# EAGLE schematic Keyboard_C64_HotSwap (EAGLE 9.6.0)
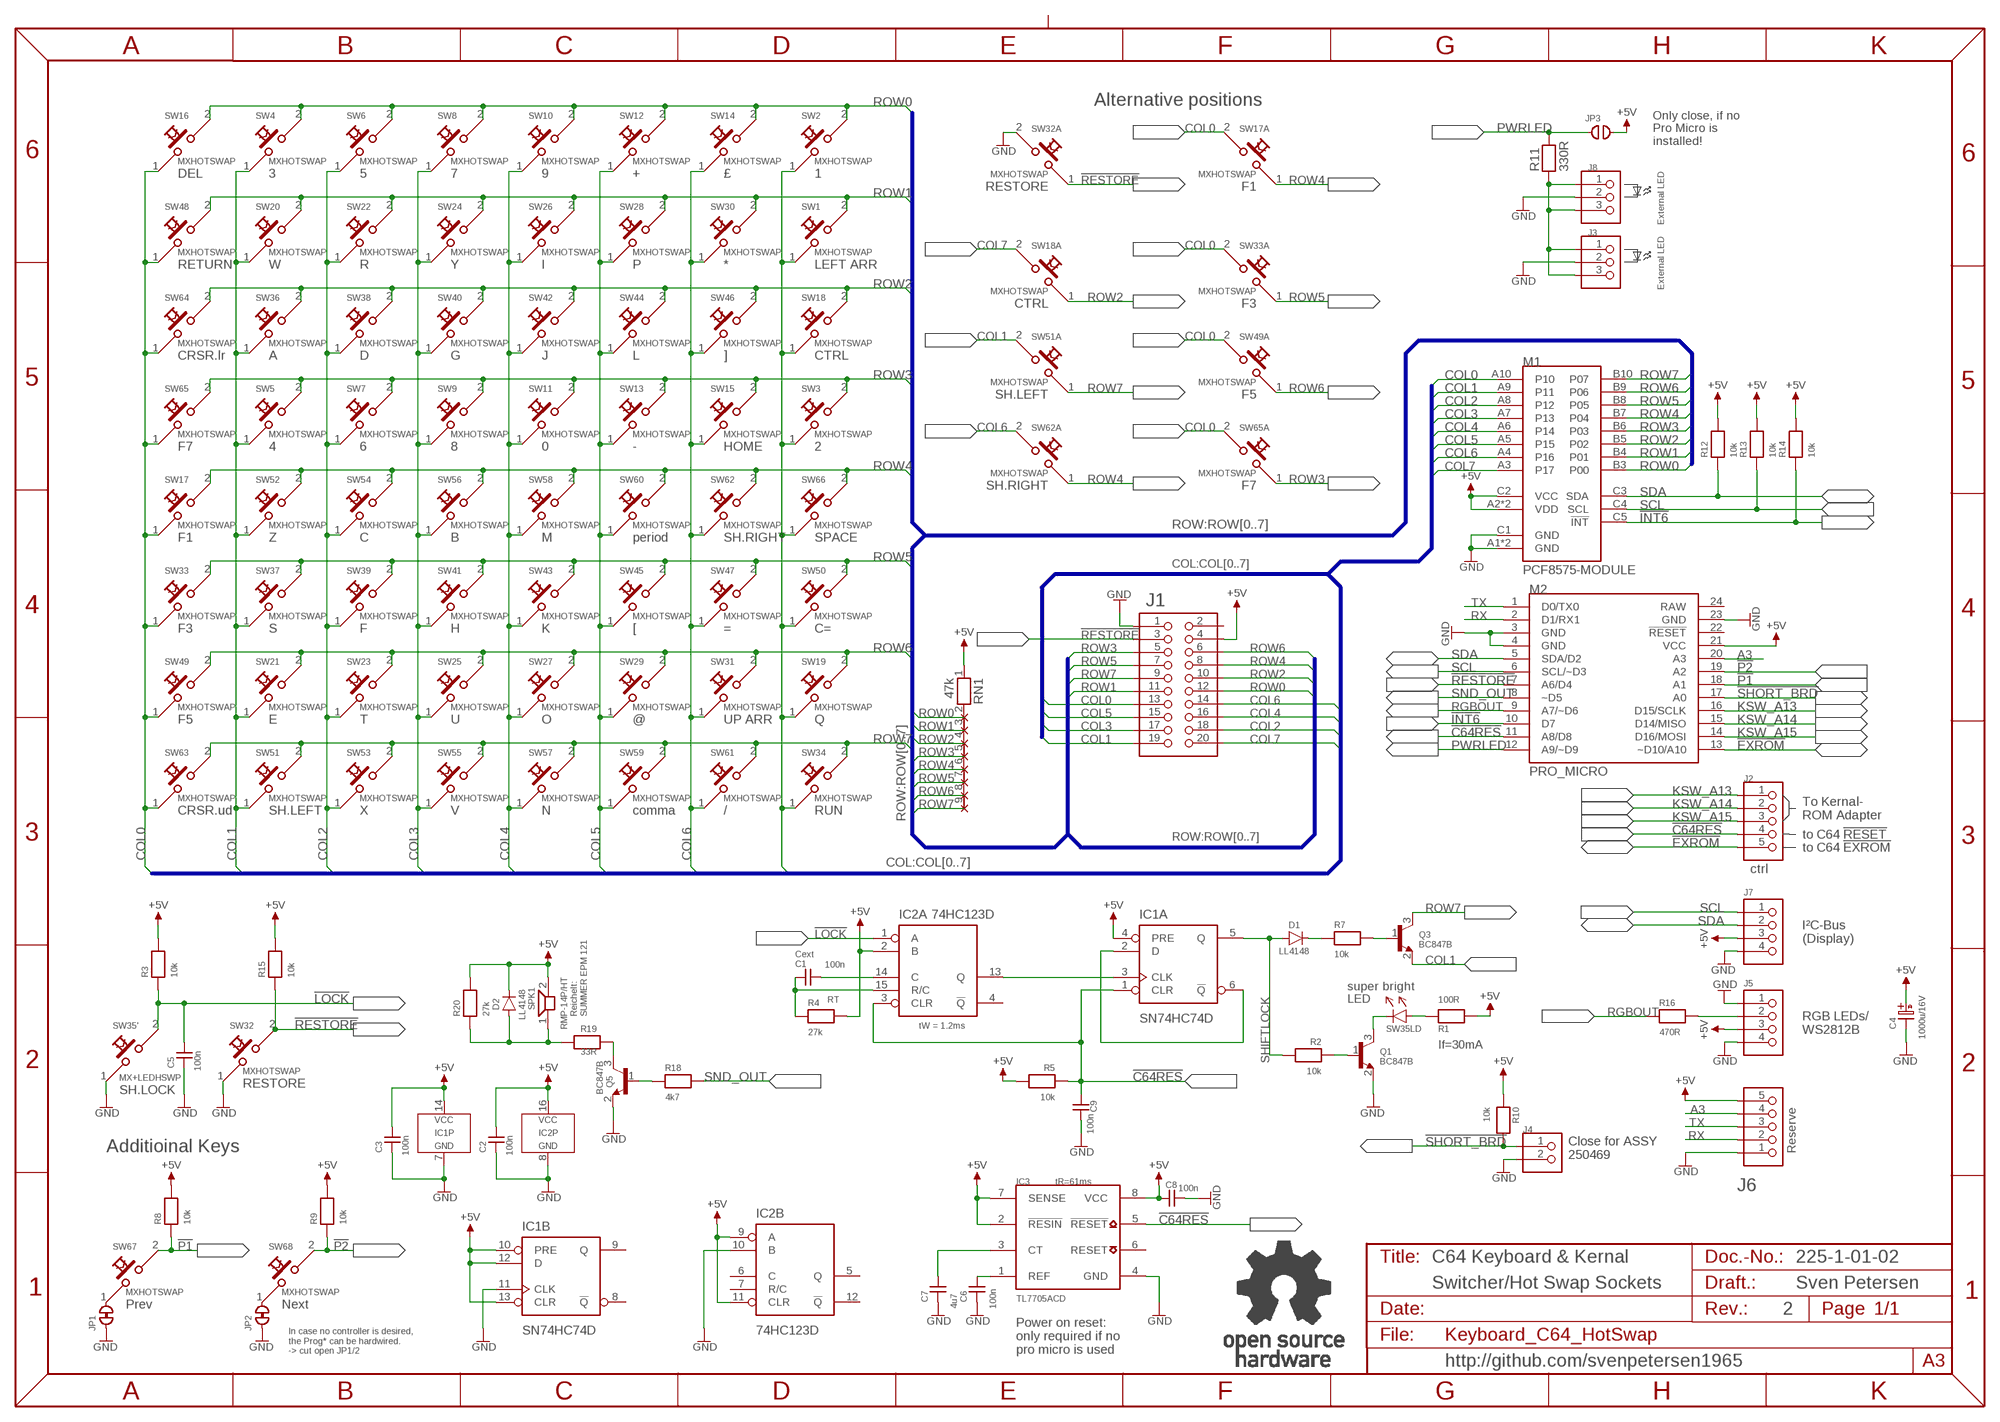
[diagram p0: schematic, sheet 1]

## Parts
C1  100n  C-0805  [0805]
C2  100n  C-0805  [0805]
C3  100n  C-0805  [0805]
C4  1000u/16V  C30X16L  [C30X16L]
C5  100n  C-0805  [0805]
C6  100n  CAP010805  [0805]
C7  4u7  CAP010805  [0805]
C8  100n  CAP010805  [0805]
C9  100n  CAP010805  [0805]
D1  LL4148  [SOD80C]
D2  LL4148  [SOD80C]
IC1  SN74HC74D  7474HC  [SO-14]
IC2  74HC123D  74123  [SO-16]
IC3  TL7705ACD  [SO8]
J1  PINHD-2X10WH  [2X10WH]
J2  PINHD-1X590°  [1X05/90]
J3  PINHD-1X3/90  [1X03/90]
J4  PINHD-1X2/90  [1X02/90]
J5  PINHD-1X4/90  [1X04/90]
J6  PINHD-1X590°  [1X05/90]
J7  PINHD-1X4/90  [1X04/90]
J8  PINHD-1X3/90  [1X03/90]
JP1  CLOSED  [CP_CL]
JP2  CLOSED  [CP_CL]
JP3  OPEN  [CP_OP]
M1  PCF8575-MODULE  PCF8575-MODUL  [PCF8575MODUL]
M2  PRO_MICRO  [PRO_MICRO]
Q1  BC847B  BC846  [SOT23]
Q3  BC847B  BC846  [SOT23]
Q5  BC847B  BC846  [SOT23]
R1  100R  R-0805  [0805]
R2  10k  R-0805  [0805]
R3  10k  R-0805  [0805]
R4  27k  R-0805  [0805]
R5  10k  R-0805  [0805]
R7  10k  R-0805  [0805]
R8  10k  R-0805  [0805]
R9  10k  R-0805  [0805]
R10  10k  R-0805  [0805]
R11  330R  RES040805  [0805]
R12  10k  R-0805  [0805]
R13  10k  R-0805  [0805]
R14  10k  R-0805  [0805]
R15  10k  R-0805  [0805]
R16  470R  R-0805  [0805]
R18  4k7  R-0805  [0805]
R19  33R  R-0805  [0805]
R20  27k  R-0805  [0805]
RN1  47k  RN08  [RN-9]
SPK1  RMP-14P/HT  [RMP-14P/HT]
SW1  MXHOTSWAP  [CHERRYMX_HOTSWAP]
SW2  MXHOTSWAP  [CHERRYMX_HOTSWAP]
SW3  MXHOTSWAP  [CHERRYMX_HOTSWAP]
SW4  MXHOTSWAP  [CHERRYMX_HOTSWAP]
SW5  MXHOTSWAP  [CHERRYMX_HOTSWAP]
SW6  MXHOTSWAP  [CHERRYMX_HOTSWAP]
SW7  MXHOTSWAP  [CHERRYMX_HOTSWAP]
SW8  MXHOTSWAP  [CHERRYMX_HOTSWAP]
SW9  MXHOTSWAP  [CHERRYMX_HOTSWAP]
SW10  MXHOTSWAP  [CHERRYMX_HOTSWAP]
SW11  MXHOTSWAP  [CHERRYMX_HOTSWAP]
SW12  MXHOTSWAP  [CHERRYMX_HOTSWAP]
SW13  MXHOTSWAP  [CHERRYMX_HOTSWAP]
SW14  MXHOTSWAP  [CHERRYMX_HOTSWAP]
SW15  MXHOTSWAP  [CHERRYMX_HOTSWAP]
SW16  MXHOTSWAP  [CHERRYMX_HOTSWAP]
SW17  MXHOTSWAP  [CHERRYMX_HOTSWAP]
SW17A  MXHOTSWAP  [CHERRYMX_HOTSWAP]
SW18  MXHOTSWAP  [CHERRYMX_HOTSWAP]
SW18A  MXHOTSWAP  [CHERRYMX_HOTSWAP]
SW19  MXHOTSWAP  [CHERRYMX_HOTSWAP]
SW20  MXHOTSWAP  [CHERRYMX_HOTSWAP]
SW21  MXHOTSWAP  [CHERRYMX_HOTSWAP]
SW22  MXHOTSWAP  [CHERRYMX_HOTSWAP]
SW23  MXHOTSWAP  [CHERRYMX_HOTSWAP]
SW24  MXHOTSWAP  [CHERRYMX_HOTSWAP]
SW25  MXHOTSWAP  [CHERRYMX_HOTSWAP]
SW26  MXHOTSWAP  [CHERRYMX_HOTSWAP]
SW27  MXHOTSWAP  [CHERRYMX_HOTSWAP]
SW28  MXHOTSWAP  [CHERRYMX_HOTSWAP]
SW29  MXHOTSWAP  [CHERRYMX_HOTSWAP]
SW30  MXHOTSWAP  [CHERRYMX_HOTSWAP]
SW31  MXHOTSWAP  [CHERRYMX_HOTSWAP]
SW32  MXHOTSWAP  [CHERRYMX_HOTSWAP]
SW32A  MXHOTSWAP  [CHERRYMX_HOTSWAP]
SW33  MXHOTSWAP  [CHERRYMX_HOTSWAP]
SW33A  MXHOTSWAP  [CHERRYMX_HOTSWAP]
SW34  MXHOTSWAP  [CHERRYMX_HOTSWAP]
SW35  MX+LEDHSWP  [CHERRYMX_HSWP_LD]
SW36  MXHOTSWAP  [CHERRYMX_HOTSWAP]
SW37  MXHOTSWAP  [CHERRYMX_HOTSWAP]
SW38  MXHOTSWAP  [CHERRYMX_HOTSWAP]
SW39  MXHOTSWAP  [CHERRYMX_HOTSWAP]
SW40  MXHOTSWAP  [CHERRYMX_HOTSWAP]
SW41  MXHOTSWAP  [CHERRYMX_HOTSWAP]
SW42  MXHOTSWAP  [CHERRYMX_HOTSWAP]
SW43  MXHOTSWAP  [CHERRYMX_HOTSWAP]
SW44  MXHOTSWAP  [CHERRYMX_HOTSWAP]
SW45  MXHOTSWAP  [CHERRYMX_HOTSWAP]
SW46  MXHOTSWAP  [CHERRYMX_HOTSWAP]
SW47  MXHOTSWAP  [CHERRYMX_HOTSWAP]
SW48  MXHOTSWAP  [CHERRYMX_HOTSWAP]
SW49  MXHOTSWAP  [CHERRYMX_HOTSWAP]
SW49A  MXHOTSWAP  [CHERRYMX_HOTSWAP]
SW50  MXHOTSWAP  [CHERRYMX_HOTSWAP]
SW51  MXHOTSWAP  [CHERRYMX_HOTSWAP]
SW51A  MXHOTSWAP  [CHERRYMX_HOTSWAP]
SW52  MXHOTSWAP  [CHERRYMX_HOTSWAP]
SW53  MXHOTSWAP  [CHERRYMX_HOTSWAP]
SW54  MXHOTSWAP  [CHERRYMX_HOTSWAP]
SW55  MXHOTSWAP  [CHERRYMX_HOTSWAP]
SW56  MXHOTSWAP  [CHERRYMX_HOTSWAP]
SW57  MXHOTSWAP  [CHERRYMX_HOTSWAP]
SW58  MXHOTSWAP  [CHERRYMX_HOTSWAP]
SW59  MXHOTSWAP  [CHERRYMX_HOTSWAP]
SW60  MXHOTSWAP  [CHERRYMX_HOTSWAP]
SW61  MXHOTSWAP  [CHERRYMX_HOTSWAP]
SW62  MXHOTSWAP  [CHERRYMX_HOTSWAP]
SW62A  MXHOTSWAP  [CHERRYMX_HOTSWAP]
SW63  MXHOTSWAP  [CHERRYMX_HOTSWAP]
SW64  MXHOTSWAP  [CHERRYMX_HOTSWAP]
SW65  MXHOTSWAP  [CHERRYMX_HOTSWAP]
SW65A  MXHOTSWAP  [CHERRYMX_HOTSWAP]
SW66  MXHOTSWAP  [CHERRYMX_HOTSWAP]
SW67  MXHOTSWAP  [CHERRYMX_HOTSWAP]
SW68  MXHOTSWAP  [CHERRYMX_HOTSWAP]
U$90  OPEN_SOURCE_HW  [OPENHW]

## Nets
!C64RES: C9.1 IC1.1(A:CLR) IC2.3(A:CLR) IC3.5(!RESET) J2.4 M2.11(A8/D8) R5.1
!EXROM: J2.5 M2.13(~D10/A10)
!INT6: M1.C5(!INT) M2.10(D7) R14.1
!LOCK: C5.2 IC2.1(A:A) R3.1 SW35.2
!P1: M2.18(A1) R8.1 SW67.2
!P2: M2.19(A2) R9.1 SW68.2
!RESTORE: J1.3 M2.7(A6/D4) R15.1 SW32.2 SW32A.1
!SHORT_BRD: J4.1 M2.17(A0) R10.2
+5V: C2.2 C3.2 C4.A(+) D2.K IC1.4(A:PRE) IC1.10(B:PRE) IC1.12(B:D) IC1.13(B:CLR) IC1.14(P:VCC) IC2.2(A:B) IC2.9(B:A) IC2.11(B:CLR) IC2.16(P:VCC) IC3.2(!RESIN) IC3.7(SENSE) J1.4 J5.3 J6.5 J7.3 JP3.2 M1.A2(VDD) M1.B2(VDD) M1.C2(VCC) M2.21(VCC) R1.2 R3.2 R4.2 R5.2 R8.2 R9.2 R10.1 R12.2 R13.2 R14.2 R15.2 R20.2 RN1.1 SPK1.2
A3: J6.4 M2.20(A3)
COL0: J1.13 M1.A10(P10) SW16.1 SW17.1 SW17A.2 SW33.1 SW33A.2 SW48.1 SW49.1 SW49A.2 SW63.1 SW64.1 SW65.1 SW65A.2
COL1: J1.19 M1.A9(P11) Q3.2(E) SW4.1 SW5.1 SW20.1 SW21.1 SW36.1 SW37.1 SW51.1 SW51A.2 SW52.1
COL2: J1.18 M1.A8(P12) SW6.1 SW7.1 SW22.1 SW23.1 SW38.1 SW39.1 SW53.1 SW54.1
COL3: J1.17 M1.A7(P13) SW8.1 SW9.1 SW24.1 SW25.1 SW40.1 SW41.1 SW55.1 SW56.1
COL4: J1.16 M1.A6(P14) SW10.1 SW11.1 SW26.1 SW27.1 SW42.1 SW43.1 SW57.1 SW58.1
COL5: J1.15 M1.A5(P15) SW12.1 SW13.1 SW28.1 SW29.1 SW44.1 SW45.1 SW59.1 SW60.1
COL6: J1.14 M1.A4(P16) SW14.1 SW15.1 SW30.1 SW31.1 SW46.1 SW47.1 SW61.1 SW62.1 SW62A.2
COL7: J1.20 M1.A3(P17) SW1.1 SW2.1 SW3.1 SW18.1 SW18A.2 SW19.1 SW34.1 SW50.1 SW66.1
GND: C2.1 C3.1 C4.K(-) C5.1 C6.1 C7.1 C8.2 C9.2 IC1.7(P:GND) IC1.11(B:CLK) IC2.8(P:GND) IC2.10(B:B) IC3.4(GND) J1.1 J3.2 J4.2 J5.1 J5.4 J6.1 J7.4 J8.2 JP1.1 JP2.1 M1.A1(GND) M1.B1(GND) M1.C1(GND) M2.3(GND) M2.4(GND) M2.23(GND) Q1.2(E) Q5.2(E) SW32.1 SW32A.2 SW35.1
KSW_A13: J2.1 M2.16(D15/SCLK)
KSW_A14: J2.2 M2.15(D14/MISO)
KSW_A15: J2.3 M2.14(D16/MOSI)
LOCK: IC1.3(A:CLK) IC2.13(A:Q)
N$1: R1.1 SW35.LDA(LD:A)
N$2: Q1.3(C) SW35.LDC(LD:K)
N$3: Q1.1(B) R2.1
N$4: C1.2 IC2.14(A:C)
N$5: IC1.2(A:D) IC1.6(A:!Q)
N$7: D1.K R7.1
N$8: Q3.1(B) R7.2
N$9: Q5.1(B) R18.1
N$10: J3.1 J3.3 J8.1 J8.3 R11.1
N$11: Q5.3(C) R19.2
N$12: D2.A R19.1 R20.1 SPK1.1
N$13: J5.2 R16.2
N$14: JP1.2 SW67.1
N$15: JP2.2 SW68.1
N$16: C1.1 IC2.15(A:R/C) R4.1
N$17: C8.1 IC3.8(VCC) ; supply symbol labelled +5V
N$18: C6.2 IC3.1(REF)
N$19: C7.2 IC3.3(CT)
PWRLED: JP3.1 M2.12(A9/~D9) R11.2
RGBOUT: M2.9(A7/~D6) R16.1
ROW0: J1.12 M1.B3(P00) RN1.2 SW2.2 SW4.2 SW6.2 SW8.2 SW10.2 SW12.2 SW14.2 SW16.2
ROW1: J1.11 M1.B4(P01) RN1.3 SW1.2 SW20.2 SW22.2 SW24.2 SW26.2 SW28.2 SW30.2 SW48.2
ROW2: J1.10 M1.B5(P02) RN1.4 SW18.2 SW18A.1 SW36.2 SW38.2 SW40.2 SW42.2 SW44.2 SW46.2 SW64.2
ROW3: J1.5 M1.B6(P03) RN1.5 SW3.2 SW5.2 SW7.2 SW9.2 SW11.2 SW13.2 SW15.2 SW65.2 SW65A.1
ROW4: J1.8 M1.B7(P04) RN1.6 SW17.2 SW17A.1 SW52.2 SW54.2 SW56.2 SW58.2 SW60.2 SW62.2 SW62A.1 SW66.2
ROW5: J1.7 M1.B8(P05) RN1.7 SW33.2 SW33A.1 SW37.2 SW39.2 SW41.2 SW43.2 SW45.2 SW47.2 SW50.2
ROW6: J1.6 M1.B9(P06) RN1.8 SW19.2 SW21.2 SW23.2 SW25.2 SW27.2 SW29.2 SW31.2 SW49.2 SW49A.1
ROW7: J1.9 M1.B10(P07) Q3.3(C) RN1.9 SW34.2 SW51.2 SW51A.1 SW53.2 SW55.2 SW57.2 SW59.2 SW61.2 SW63.2
RX: J6.2 M2.2(D1/RX1)
SCL: J7.1 M1.C4(SCL) M2.6(SCL/~D3) R13.1
SDA: J7.2 M1.C3(SDA) M2.5(SDA/D2) R12.1
SHIFTLOCK: D1.A IC1.5(A:Q) R2.2
SND_OUT: M2.8(~D5) R18.2
TX: J6.3 M2.1(D0/TX0)
Unconnected: IC1.8(B:!Q) IC1.9(B:Q) IC2.4(A:!Q) IC2.5(B:Q) IC2.6(B:C) IC2.7(B:R/C) IC2.12(B:!Q) IC3.6(RESET) J1.2 M2.22(!RESET)

## Buses
COL:COL[0..7]
ROW:ROW[0..7]

## Notes on the sheet
- Alternative positions
- Only close, if no
  Pro Micro is 
  installed!
- External LED
- External LED
- To Kernal-
  ROM Adapter
- to C64 !RESET
- to C64 !EXROM
- ctrl
- I²C-Bus
  (Display)
- Cext
- RT
- super bright
  LED
- Reichelt:
  SUMMER EPM 121
- RGB LEDs/
  WS2812B
- tW = 1.2ms
- If=30mA
- Reserve
- Additioinal Keys
- Close for ASSY
  250469
- tR=61ms
- C64 Keyboard & Kernal | 225-1-01-02
- Switcher/Hot Swap Sockets | Sven Petersen
- 2
- In case no controller is desired,
  the Prog* can be hardwired.
  -> cut open JP1/2
- Power on reset:
  only required if no 
  pro micro is used
- http://github.com/svenpetersen1965

## Power pins joined to a net without a drawn wire
RAW: M2.24(RAW)

## Library data of the parts
C1-C3 C5 = SMD:C-0805
C4 = ELCO:C30X16L
C6-C9 = DISCRETE:CAP01
D1 D2 = Dioden:LL4148
IC1 = 74XXsmd:7474*: Dual D-Flip-Flop SO14
IC2 = 74XXsmd:74123
IC3 = Texas_Instruments:TL7705
J1 = PINHEAD:PINHD-2X10
J2 J6 = PINHEAD:PINHD-1X5
J3 J8 = PINHEAD:PINHD-1X3
J4 = PINHEAD:PINHD-1X2
J5 J7 = PINHEAD:PINHD-1X4
JP1 JP2 = Cutpad:CLOSED: Closed Cutpad
JP3 = Cutpad:OPEN: open Cutpad
M1 = Arduino:PCF8575-MODUL
M2 = Arduino:PRO_MICRO
Q1 Q3 Q5 = Transistoren:BC846
R1-R5 R7-R10 R12-R16 R18-R20 = SMD:R-0805
R11 = DISCRETE:RES04
RN1 = DISCRETE:RN08
SPK1 = KM:RMP-14P/HT
SW1 = CherryMX:MX; KEY: LEFT ARR
SW2 = CherryMX:MX; KEY: 1
SW3 = CherryMX:MX; KEY: 2
SW4 = CherryMX:MX; KEY: 3
SW5 = CherryMX:MX; KEY: 4
SW6 = CherryMX:MX; KEY: 5
SW7 = CherryMX:MX; KEY: 6
SW8 = CherryMX:MX; KEY: 7
SW9 = CherryMX:MX; KEY: 8
SW10 = CherryMX:MX; KEY: 9
SW11 = CherryMX:MX; KEY: 0
SW12 = CherryMX:MX; KEY: +
SW13 = CherryMX:MX; KEY: -
SW14 = CherryMX:MX; KEY: £
SW15 = CherryMX:MX; KEY: HOME
SW16 = CherryMX:MX; KEY: DEL
SW17 SW17A = CherryMX:MX; KEY: F1
SW18 SW18A = CherryMX:MX; KEY: CTRL
SW19 = CherryMX:MX; KEY: Q
SW20 = CherryMX:MX; KEY: W
SW21 = CherryMX:MX; KEY: E
SW22 = CherryMX:MX; KEY: R
SW23 = CherryMX:MX; KEY: T
SW24 = CherryMX:MX; KEY: Y
SW25 = CherryMX:MX; KEY: U
SW26 = CherryMX:MX; KEY: I
SW27 = CherryMX:MX; KEY: O
SW28 = CherryMX:MX; KEY: P
SW29 = CherryMX:MX; KEY: @
SW30 = CherryMX:MX; KEY: *
SW31 = CherryMX:MX; KEY: UP ARR
SW32 SW32A = CherryMX:MX; KEY: RESTORE
SW33 SW33A = CherryMX:MX; KEY: F3
SW34 = CherryMX:MX; KEY: RUN
SW35 = CherryMX:MX+LED; KEY: SH.LOCK
SW36 = CherryMX:MX; KEY: A
SW37 = CherryMX:MX; KEY: S
SW38 = CherryMX:MX; KEY: D
SW39 = CherryMX:MX; KEY: F
SW40 = CherryMX:MX; KEY: G
SW41 = CherryMX:MX; KEY: H
SW42 = CherryMX:MX; KEY: J
SW43 = CherryMX:MX; KEY: K
SW44 = CherryMX:MX; KEY: L
SW45 = CherryMX:MX; KEY: [
SW46 = CherryMX:MX; KEY: ]
SW47 = CherryMX:MX; KEY: =
SW48 = CherryMX:MX; KEY: RETURN
SW49 SW49A = CherryMX:MX; KEY: F5
SW50 = CherryMX:MX; KEY: C=
SW51 SW51A = CherryMX:MX; KEY: SH.LEFT
SW52 = CherryMX:MX; KEY: Z
SW53 = CherryMX:MX; KEY: X
SW54 = CherryMX:MX; KEY: C
SW55 = CherryMX:MX; KEY: V
SW56 = CherryMX:MX; KEY: B
SW57 = CherryMX:MX; KEY: N
SW58 = CherryMX:MX; KEY: M
SW59 = CherryMX:MX; KEY: comma
SW60 = CherryMX:MX; KEY: period
SW61 = CherryMX:MX; KEY: /
SW62 SW62A = CherryMX:MX; KEY: SH.RIGHT
SW63 = CherryMX:MX; KEY: CRSR.ud
SW64 = CherryMX:MX; KEY: CRSR.lr
SW65 SW65A = CherryMX:MX; KEY: F7
SW66 = CherryMX:MX; KEY: SPACE
SW67 = CherryMX:MX; KEY: Prev
SW68 = CherryMX:MX; KEY: Next
U$90 = Logo:OPEN_SOURCE_HW